# Altium schematic sheet LINEARDriver_Bridge.SchDoc: Плата драйвера KUBO
size 420 x 297 mm; ApprovedBy: Иванов; CheckedBy: Вакулин; DrawnBy: Подлесный; DocumentNumber: BSV.23-KUBODRIVER Э3; SheetNumber: 1; SheetTotal: 5; DocumentType: Схема электрическая принципиальная; Format: A3; ImagePath: Введите номер платы
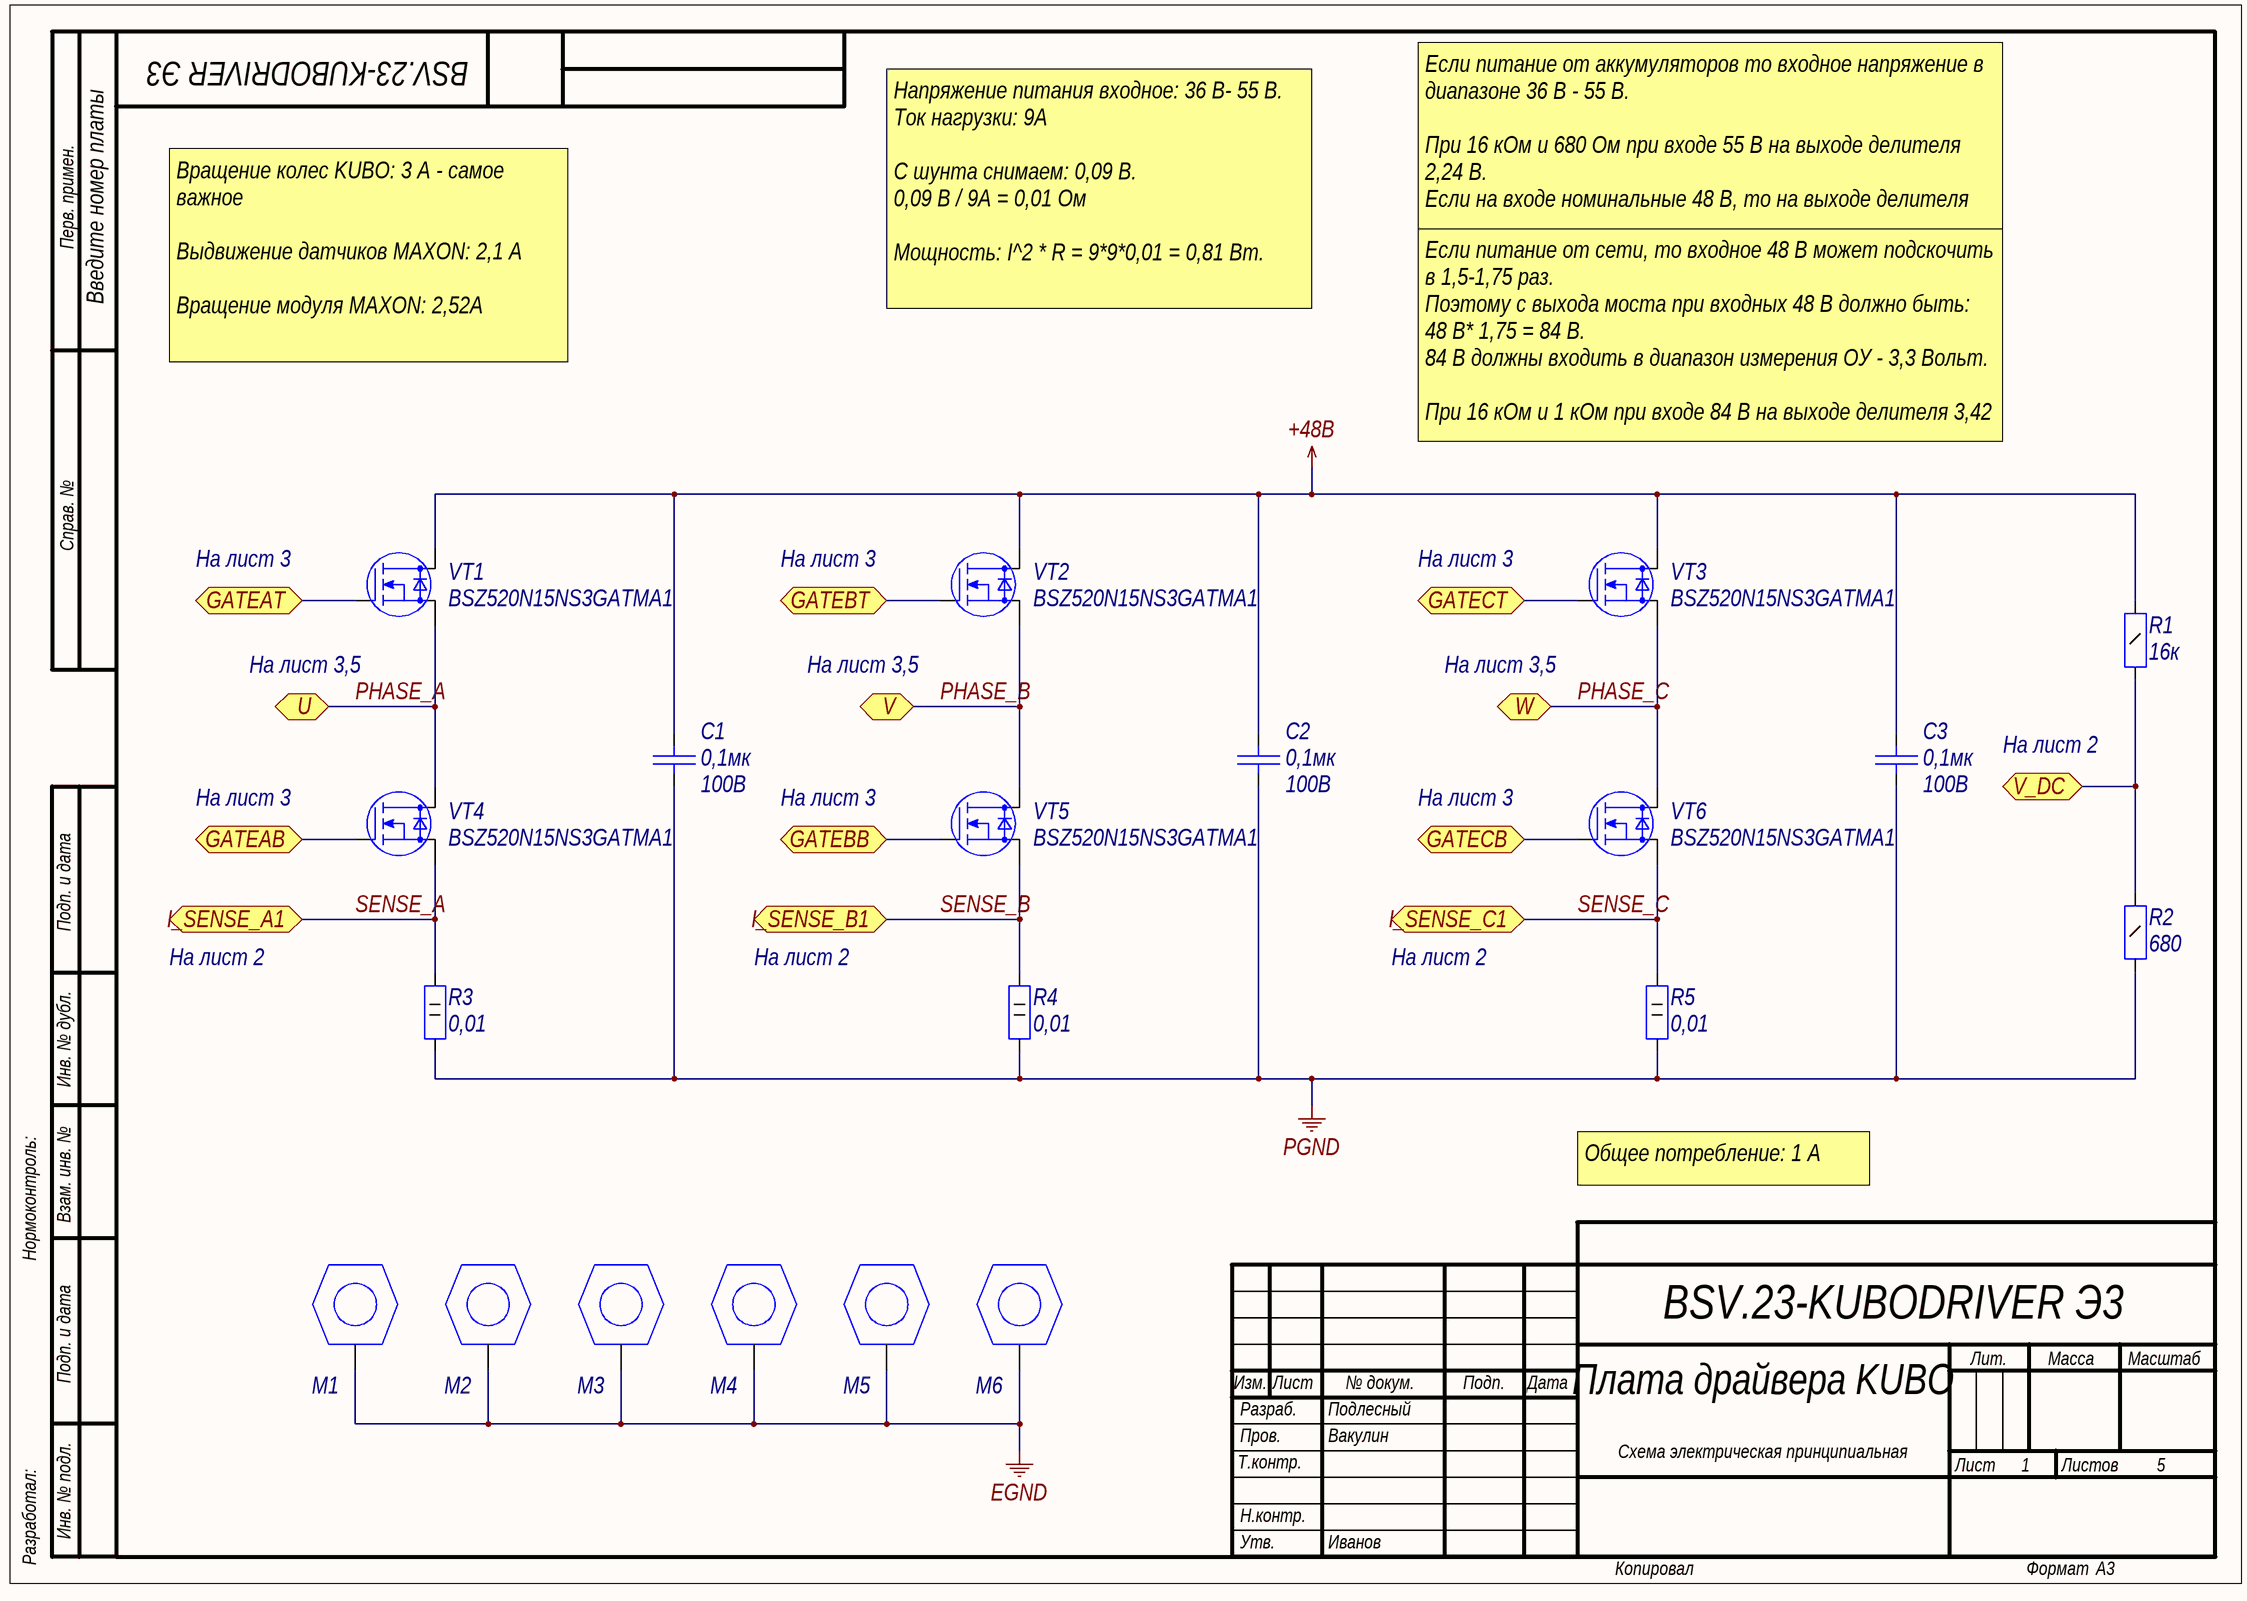
[diagram p0: LINEARDriver_Bridge.SchDoc]

## Parts
C1  Voltage: 100В  [C1206]  (hidden comment: 0,1мк)
C2  Voltage: 100В  [C1206]  (hidden comment: 0,1мк)
C3  Voltage: 100В  [C1206]  (hidden comment: 0,1мк)
M1  SCREW  [SCREW3]  (value not drawn)
M2  SCREW  [SCREW3]  (value not drawn)
M3  SCREW  [SCREW3]  (value not drawn)
M4  SCREW  [SCREW3]  (value not drawn)
M5  SCREW  [SCREW3]  (value not drawn)
M6  SCREW  [SCREW3]  (value not drawn)
R1  value 16к  [R1206]  (hidden comment: Resistor_0,25Вт)
R2  value 680  [R1206]  (hidden comment: Resistor_0,25Вт)
R3  0,01  [R2512]
R4  0,01  [R2512]
R5  0,01  [R2512]
VT1  Part Number: BSZ520N15NS3GATMA1  [TSDSON8]  (hidden comment: N-MOSFET)
VT2  Part Number: BSZ520N15NS3GATMA1  [TSDSON8]  (hidden comment: N-MOSFET)
VT3  Part Number: BSZ520N15NS3GATMA1  [TSDSON8]  (hidden comment: N-MOSFET)
VT4  Part Number: BSZ520N15NS3GATMA1  [TSDSON8]  (hidden comment: N-MOSFET)
VT5  Part Number: BSZ520N15NS3GATMA1  [TSDSON8]  (hidden comment: N-MOSFET)
VT6  Part Number: BSZ520N15NS3GATMA1  [TSDSON8]  (hidden comment: N-MOSFET)

## Ports
GATEAB, GATEAT, GATEBB, GATEBT, GATECB, GATECT, I_SENSE_A1, I_SENSE_B1, I_SENSE_C1, U, V, V_DC, W

## Nets
+48B: C1.2 C2.2 C3.2 R1.2 VT1.2(D) VT2.2(D) VT3.2(D)
EGND: M1.1 M2.1 M3.1 M4.1 M5.1 M6.1
PGND: C1.1 C2.1 C3.1 R2.1 R3.1 R4.1 R5.1
GATEAB: VT4.1(G) ; port GATEAB
GATEAT: VT1.1(G) ; port GATEAT
GATEBB: VT5.1(G) ; port GATEBB
GATEBT: VT2.1(G) ; port GATEBT
GATECB: VT6.1(G) ; port GATECB
GATECT: VT3.1(G) ; port GATECT
PHASE_A: VT1.3(S) VT4.2(D) ; port U
PHASE_B: VT2.3(S) VT5.2(D) ; port V
PHASE_C: VT3.3(S) VT6.2(D) ; port W
SENSE_A: R3.2 VT4.3(S) ; port I_SENSE_A1
SENSE_B: R4.2 VT5.3(S) ; port I_SENSE_B1
SENSE_C: R5.2 VT6.3(S) ; port I_SENSE_C1
V_DC: R1.1 R2.2 ; port V_DC

## Notes on the sheet
- Перв. примен.
- Если питание от аккумуляторов то входное напряжение в диапазоне 36 В - 55 B.
  При 16 кОм и 680 Ом при входе 55 В на выходе делителя 2,24 В.
  Если на входе номинальные 48 В, то на выходе делителя 1,96 В.
  Если на входе 36 В, то на выходе делителя 1,47 В.
- Напряжение питания входное: 36 B- 55 В.
  Ток нагрузки: 9А
  С шунта снимаем: 0,09 B.
  0,09 B / 9A = 0,01 Ом
  Мощность: I^2 * R = 9*9*0,01 = 0,81 Вт.
- Вращение колес KUBO: 3 А - самое важное
  Выдвижение датчиков MAXON: 2,1 А
  Вращение модуля MAXON: 2,52А
  Выдвижение УЗ датчика MAXON: 0,748А
- Если питание от сети, то входное 48 В может подскочить в 1,5-1,75 раз.
  Поэтому с выхода моста при входных 48 В должно быть:
  48 В* 1,75 = 84 В.
  84 В должны входить в диапазон измерения ОУ - 3,3 Вольт.
  При 16 кОм и 1 кОм при входе 84 В на выходе делителя 3,42 В.
- Справ. №
- На лист 3
- (near VT1) На лист 3,5
- (near VT2) На лист 3,5
- (near VT3) На лист 3,5
- На лист 2
- Подп. и дата
- Инв. № дубл.
- Нормоконтроль:
- Взам. инв. №
- Общее потребление: 1 A
- Изм.
- Лист
- № докум.
- Подп.
- Дата
- Лит.
- Масса
- Масштаб
- Т.контр.
- Пров.
- Разраб.
- Листов
- Разработал:
- Инв. № подл.
- Н.контр.
- Утв.
- Копировал
- Формат

## Library data of the parts
C1-C3 = cap286: Конденсатор; Part Name: Ceramic; Manufacture: Murata; Part Number: GRM31C5C2A104JA01L; id: cap286; TKE: NP0; Value: 0,1мк
M1-M6 = connect89: Part Name: Винт М3 с заземлением; Contact_1: EGND; id: connect89
R1 = res685: Резистор; Manufacture: Yageo; Part Number: RC1206FR-0716KL; id: res685; Accuracy: 0,01; Power: 0,25Вт; Part Name: Resistor
R2 = res652: Резистор; Manufacture: Yageo; Part Number: RC1206FR-07680RL; id: res652; Accuracy: 0,01; Power: 0,25Вт; Part Name: Resistor
R3-R5 = res1169: Резистор; Part Name: Shunt; Manufacture: Bourns; Part Number: CRA2512-FZ-R010ELF; Power: 2Вт; Value: 0,01; id: res1169; Accuracy: 0,01
VT1-VT6 = mosfert23: Manufacturer: Infineon Technologies; Structure: n-channel; V drain-source max: 150B; Rds: 0,052Ohm; Gate-to-source voltage: (+-)20B; Continuous drain current: 21A; Total gate charge: 12nC; Pulsed drain current: 84A; Power dissipation: 57W; id: mosfert23